# Altium schematic sheet UNO Mega IO.SchDoc
size A; SheetNumber: 4; SheetTotal: 4
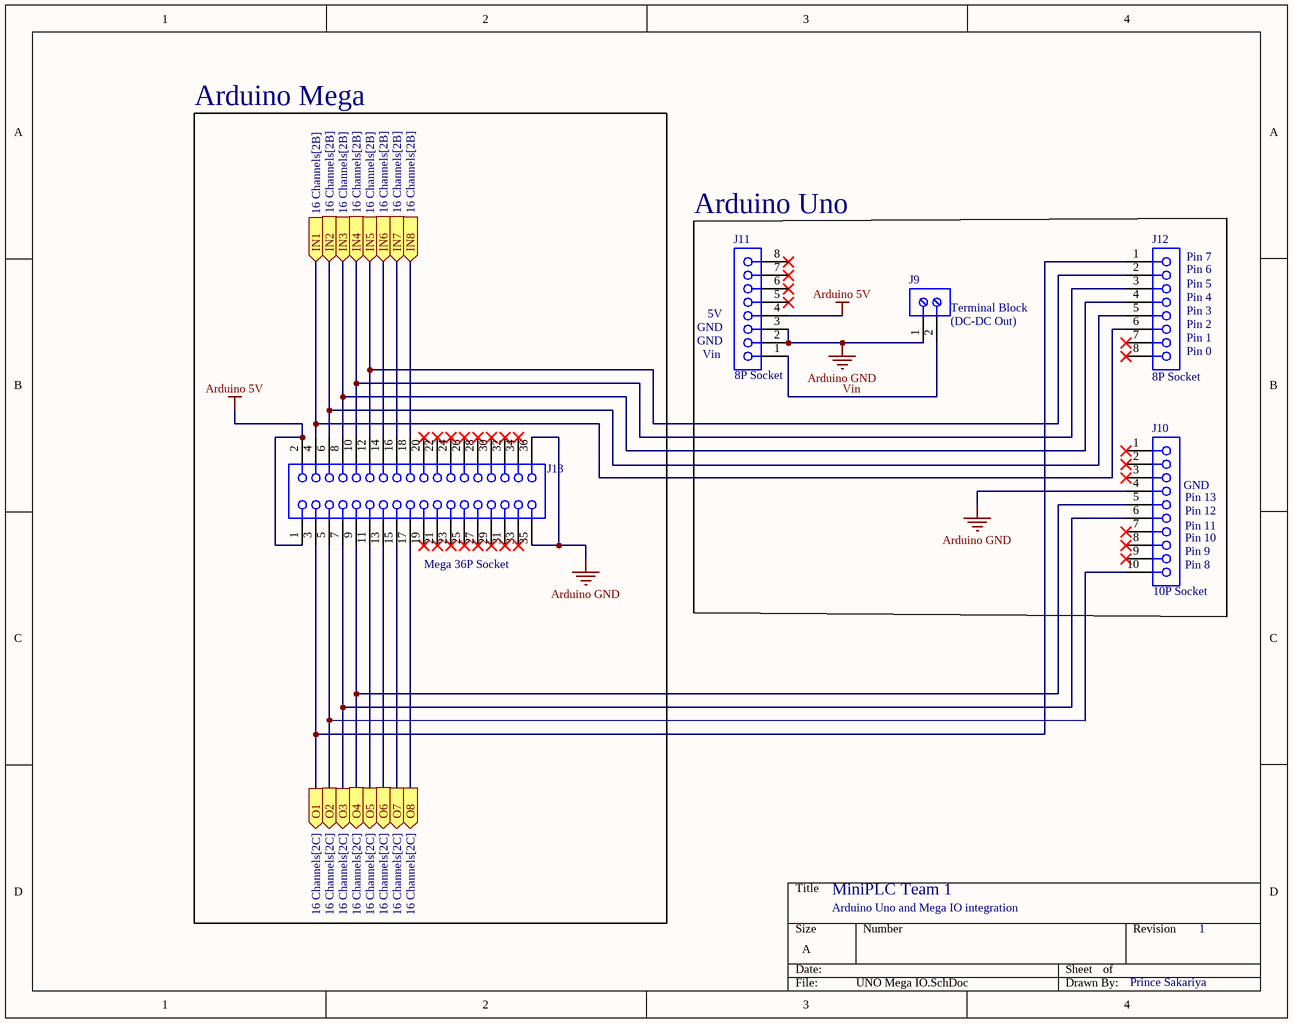
[diagram p0: UNO Mega IO.SchDoc]

## Parts
J9  Terminal Block  [691103110002]
J10  10P Socket  [61301011821]
J11  8P Socket  [61300811821]
J12  8P Socket  [61300811821]
J13  Mega 36P Socket  [61303621821]

## Blocks framed on the sheet
Arduino Mega: J13

## Ports
IN1 (in, see 16 Channels[2B]), IN2 (in, see 16 Channels[2B]), IN3 (in, see 16 Channels[2B]), IN4 (in, see 16 Channels[2B]), IN5 (in, see 16 Channels[2B]), IN6 (in, see 16 Channels[2B]), IN7 (in, see 16 Channels[2B]), IN8 (in, see 16 Channels[2B]), O1 (out, see 16 Channels[2C]), O2 (out, see 16 Channels[2C]), O3 (out, see 16 Channels[2C]), O4 (out, see 16 Channels[2C]), O5 (out, see 16 Channels[2C]), O6 (out, see 16 Channels[2C]), O7 (out, see 16 Channels[2C]), O8 (out, see 16 Channels[2C])

## Nets
Arduino 5V: J11.4 J13.1 J13.2
Arduino GND: J9.1 J10.4 J11.2 J11.3 J13.35 J13.36
IN1: J12.6 J13.4 ; port IN1
IN2: J12.5 J13.6 ; port IN2
IN3: J12.4 J13.8 ; port IN3
IN4: J12.3 J13.10 ; port IN4
IN5: J12.2 J13.12 ; port IN5
IN6: J13.14 ; port IN6
IN7: J13.16 ; port IN7
IN8: J13.18 ; port IN8
O1: J12.1 J13.3 ; port O1
O2: J10.10 J13.5 ; port O2
O3: J10.6 J13.7 ; port O3
O4: J10.5 J13.9 ; port O4
O5: J13.11 ; port O5
O6: J13.13 ; port O6
O7: J13.15 ; port O7
O8: J13.17 ; port O8
Vin: J9.2 J11.1

Not connected (* = marked no-connect by the designer): J10 1* 2* 3* 7* 8* 9*; J11 5* 6* 7* 8*; J12 7* 8*; J13 19* 20* 21* 22* 23* 24* 25* 26* 27* 28* 29* 30* 31* 32* 33* 34*

## Notes on the sheet
- (near J11) Arduino Uno
- (near J12) Pin 7
- (near J12) Pin 6
- (near J12) Pin 5
- (near J12) Pin 4
- (near J11) GND
- (near J11) Vin
- (near J11) 5V
- (near J9) (DC-DC Out)
- (near J12) Pin 3
- (near J12) Pin 2
- (near J12) Pin 1
- (near J12) Pin 0
- (near J10) GND
- (near J10) Pin 13
- (near J10) Pin 12
- (near J10) Pin 11
- (near J10) Pin 10
- (near J10) Pin 9
- (near J10) Pin 8
- Arduino Uno and Mega IO integration
- MiniPLC Team 1
- 1
- Prince Sakariya

## Library data of the parts
J9 = CMP-1502-03254-2: NexarPartId: 18818286; Pitch: 3.5052mm; Current Rating: 10A; Number of Positions Per Level: 2; Plating: Steel; Number of Levels: 1; Voltage: 125V; Wire/Cable Gauge: 26AWG; Stripping Length: -6mm; Wire Gauge (Min): 16AWG; Packaging: Box; Number of Rows: 1; Color: Blue; Height: 8.5mm; Current: 10A; Lead Pitch: 3.5mm; RoHS: Compliant; Housing Material: Nylon; Width: 8mm; Length: 7mm; Contact Plating: Tin; Number of Pins: 2; Mount: Through Hole; Min Operating Temperature: -40°C; Number of Contacts: 2; REACH SVHC: Unknown; Termination: Screw; Wire Gauge (Max): 26AWG; Max Operating Temperature: 105°C; Voltage Rating: 125V; Contact Material: Brass, Copper, Nickel, Tin, Zinc
J10 = CMP-1502-01332-2: NexarPartId: 18818160; Insulation: Insulated; Pitch: 2.54mm; Insulation Resistance: 1GΩ; Gender: Female; Contact Resistance: 20mΩ; Current Rating: 3A; Number of Positions: 10; Connector Type: Header, Socket; Operating Supply Voltage: 250V; Flammability Rating: UL94 V-0; RoHS: Compliant; Max Operating Temperature: 125°C; Length: 25.9mm; Contact Gender: Female; Contact Plating: Gold; REACH SVHC: Unknown; Number of Pins: 10; Number of Rows: 1; Termination: Through Hole; Orientation: Vertical; Contact Material: Copper; Color: Black; Mount: Through Hole; Width: 25.9mm; Height: 8.5mm; Number of Contacts: 10; Housing Material: PBT; Lead Free: Lead Free; Lead Pitch: 2.54mm; Min Operating Temperature: -40°C; Voltage Rating: 250V
J11 J12 = CMP-1502-01327-2: NexarPartId: 61924723; Contact Resistance: 20mΩ; Current Rating: 3A; Operating Supply Voltage: 250V; Gender: Female; Number of Pins: 8; Orientation: Vertical; Lead Pitch: 2.54mm; RoHS: Non-Compliant
J13 = CMP-1502-01368-2: NexarPartId: 24514095; Current Rating: 3A; Contact Resistance: 20mΩ; Operating Supply Voltage: 250V; Gender: Female; RoHS: Non-Compliant; Orientation: Vertical; Lead Pitch: 2.54mm; Number of Pins: 36